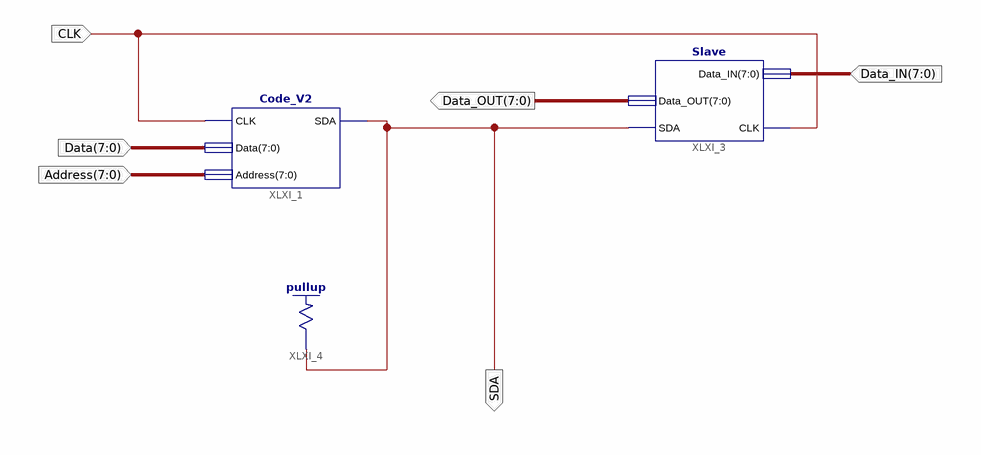
[diagram p0: schematic sheet 1]
// Xilinx ISE schematic Main.sch (spartan3e) as structural Verilog: 3 symbols, 6 ports
module Main (
  input  [7:0] Data,
  input  [7:0] Address,
  input  CLK,
  input  [7:0] Data_IN,
  output SDA,
  output [7:0] Data_OUT
);

  Code_V2 XLXI_1 (.CLK(CLK), .Data(Data), .Address(Address), .SDA(SDA));
  Slave XLXI_3 (.CLK(CLK), .Data_IN(Data_IN), .SDA(SDA), .Data_OUT(Data_OUT));
  \pullup  XLXI_4 (.O(SDA));
endmodule
